# Altium schematic sheet 07_CAN.SchDoc
size 420 x 297 mm; SheetNumber: 2; SheetTotal: 20
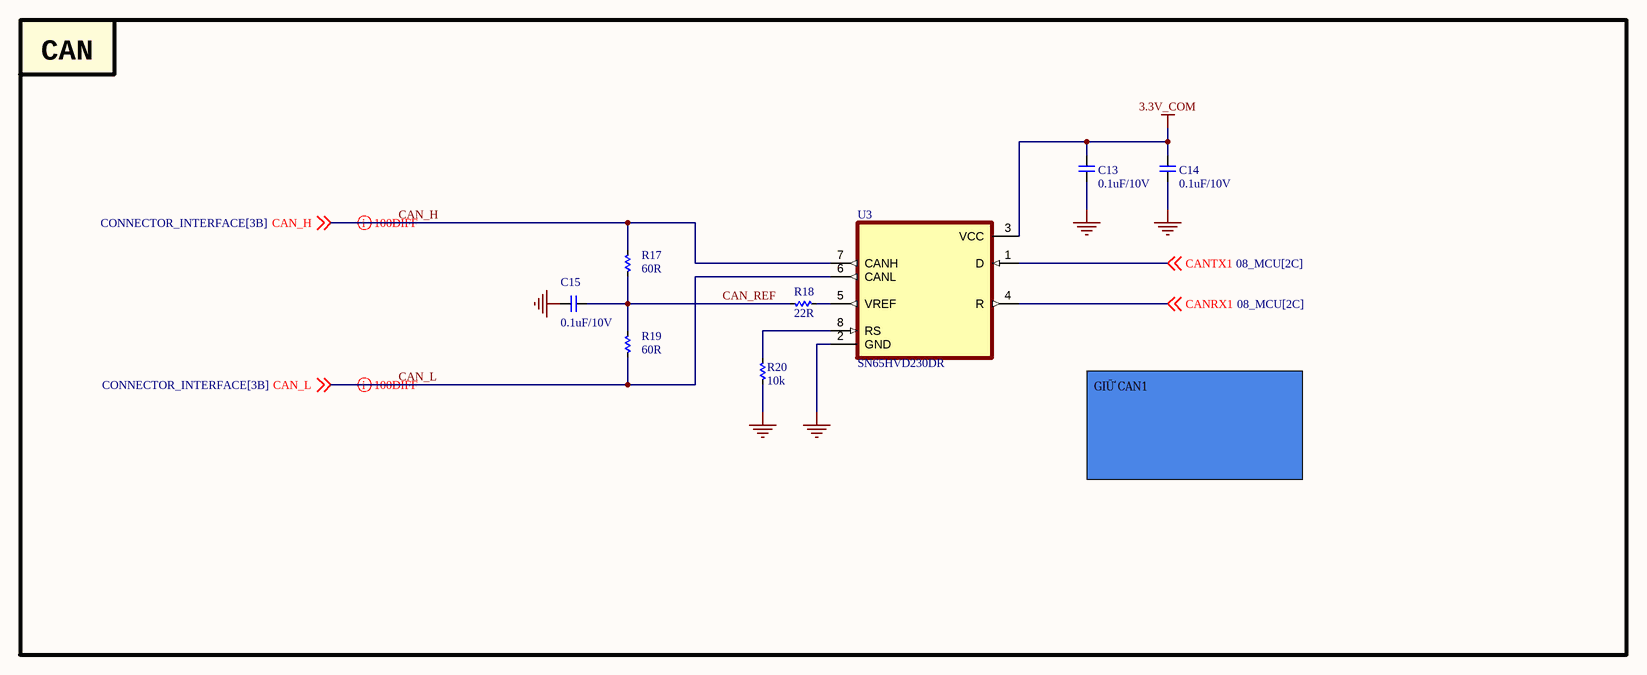
[diagram p0: 07_CAN.SchDoc]

## Parts
C13  0.1uF/10V  [CAP_C_1005X50_L]
C14  0.1uF/10V  [CAP_C_1005X50_L]
C15  0.1uF/10V  [CAP_C_1005X50_L]
R17  60R  [RES_C_1005X40]
R18  22R  [RES_C_1005X40]
R19  60R  [RES_C_1005X40]
R20  10k  [RES_C_1005X40]
U3  SN65HVD230DR  [SOIC127P600X175-8N]

## Blocks framed on the sheet
CAN: C13-C15 R17-R20 U3

## Nets
3.3V_COM: C13.1 C14.1 U3.3(VCC)
GND: C13.2 C14.2 C15.2 R20.1 U3.2(GND)
CAN_H: R17.2 U3.7(CANH) ; off-sheet CAN_H
CAN_L: R19.1 U3.6(CANL) ; off-sheet CAN_L
CAN_REF: C15.1 R17.1 R18.1 R19.2
CANRX1: U3.4(R) ; off-sheet CANRX1
CANTX1: U3.1(D) ; off-sheet CANTX1
NetR18_2: R18.2 U3.5(VREF)
NetR20_2: R20.2 U3.8(RS)

## Layout directives
differential pair; differential pair class DIFF100: CAN_H, CAN_L

## Notes on the sheet
- GIỮ CAN1
- Project:
- Sub-system:
- Design by:
- Sheet title:
- Sheet
- of
- Checked by:
- Approved by:
- Revision:
- Document No:
- Size:
- Date:
- A3

## Library data of the parts
C13-C15 = _CAP_C_2: CAP
R17-R20 = _RES_B_2: RES
U3 = SN65HVD230DR: 3.3 V CAN Transceiver with Standby Mode; MF: Texas Instruments; SnapEDA_Link: https://www.snapeda.com/parts/SN65HVD230DR/Texas+Instruments/view-part/?ref=snap; Package: SOIC-8 Texas Instruments; Value: *; MP: SN65HVD230DR; Check_prices: https://www.snapeda.com/parts/SN65HVD230DR/Texas+Instruments/view-part/?ref=eda